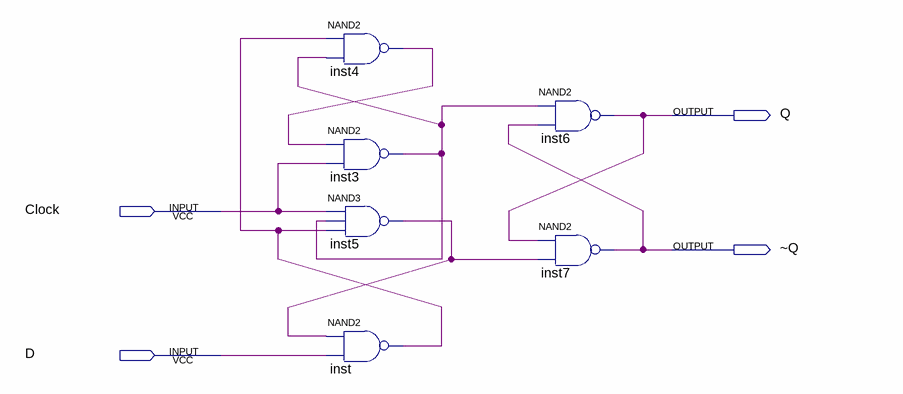
[diagram p0: schematic sheet]
// Quartus schematic lab9steb3b.bdf as structural Verilog: 6 symbols, 4 pins
module lab9steb3b (
  input  Clock,
  input  D,
  output Q,
  output \~Q 
);

  wire inst3_out, inst4_out, inst5_out, inst_out;

  nand inst4 (inst4_out, inst_out, inst3_out);
  nand inst3 (inst3_out, inst4_out, Clock);
  nand inst5 (inst5_out, Clock, inst3_out, inst_out);
  nand inst (inst_out, inst5_out, D);
  nand inst6 (Q, inst3_out, \~Q );
  nand inst7 (\~Q , Q, inst5_out);
endmodule
